# Altium schematic sheet 4_IMU.SchDoc: DB_ADCS IMU
size A4; DrawnBy: Augusto Cezar Boldori Vassoler; Revision: V1.0; SheetNumber: 4; SheetTotal: 7
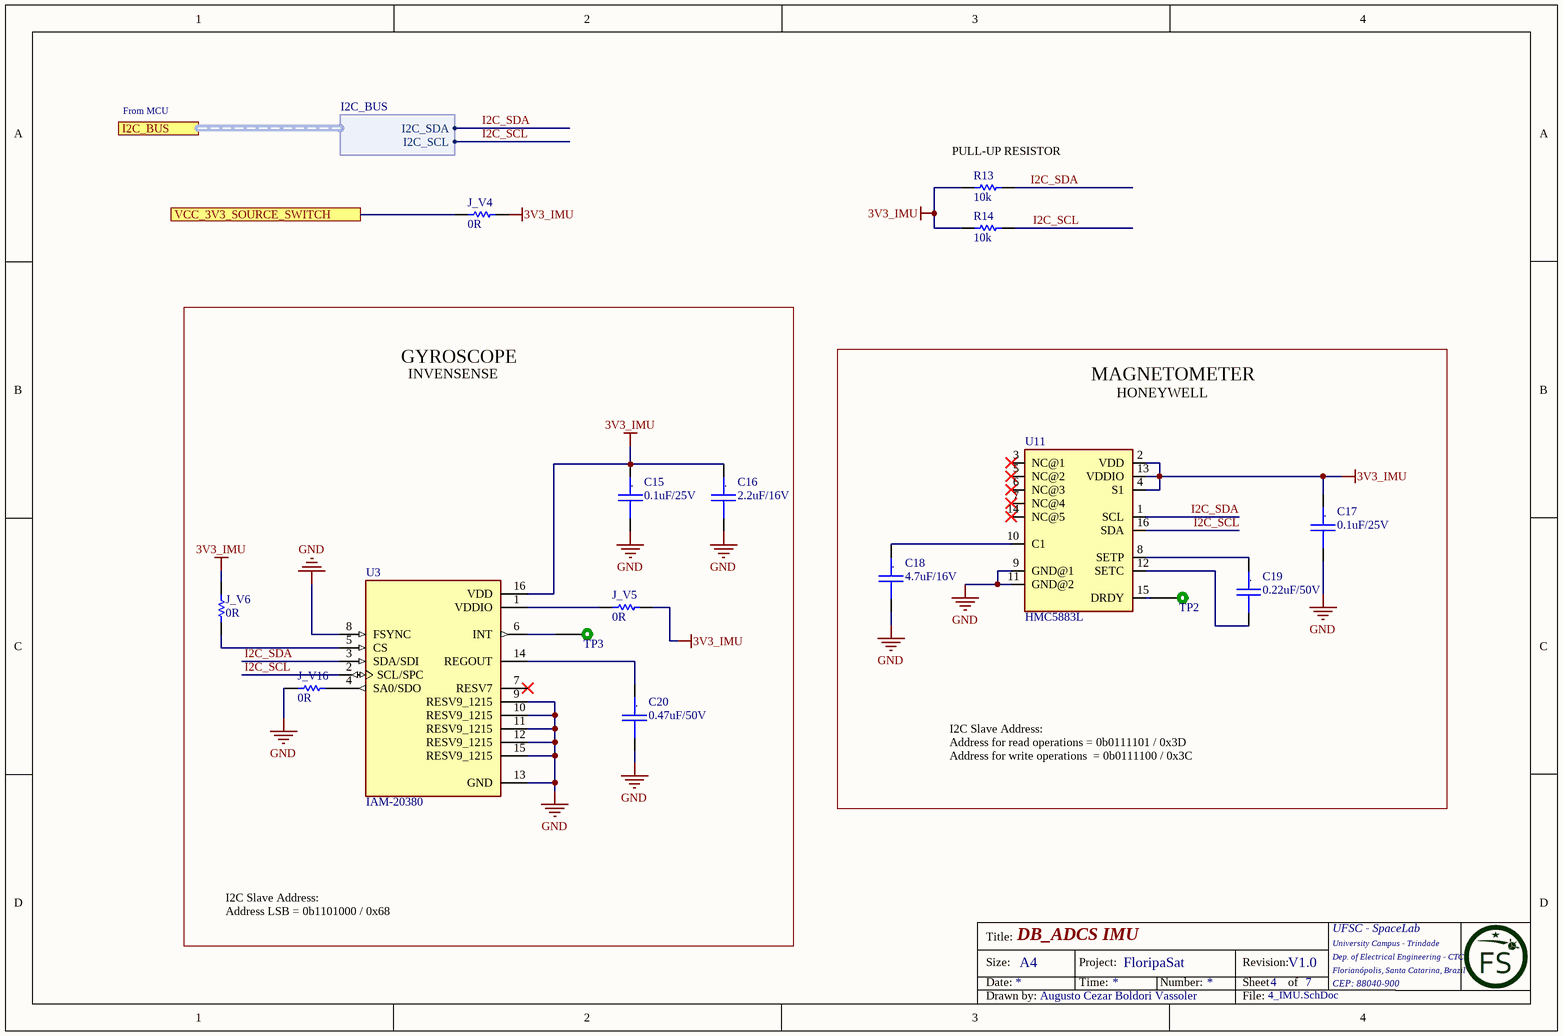
[diagram p0: 4_IMU.SchDoc]

## Parts
C15  0.1uF/25V  [CC0805]
C16  2.2uF/16V  [CC0805]
C17  0.1uF/25V  [CC0805]
C18  4.7uF/16V  [CC0805]
C19  0.22uF/50V  [CC0805]
C20  0.47uF/50V  [CC0805]
J_V4  0R  [0805-LED]
J_V5  0R  [0805-LED]
J_V6  0R  [0805-LED]
J_V16  0R  [0805-LED]
R13  10k  [0805]
R14  10k  [0805]
TP2  TEST_POINT_2  [TEST_POINT_2]  (value not drawn)  (no BOM)
TP3  TEST_POINT_2  [TEST_POINT_2]  (value not drawn)  (no BOM)
U3  IAM-20380  [PQFN50P300X300X80-16N]
U11  HMC5883L  [LPCC-16]

## Blocks framed on the sheet
GYROSCOPE: C15 C16 C20 J_V5 J_V6 J_V16 TP3 U3
MAGNETOMETER: C17-C19 TP2 U11

## Ports
I2C_BUS (harness I2C_BUS), VCC_3V3_SOURCE_SWITCH

## Harnesses
I2C_BUS: I2C_SCL, I2C_SDA

## Nets
3V3_IMU: C15.1 C16.1 C17.1 J_V4.1 J_V5.1 J_V6.2 R13.2 R14.2 U3.16(VDD) U11.2(VDD) U11.4(S1) U11.13(VDDIO)
GND: C15.2 C16.2 C17.2 C18.2 C20.2 J_V16.2 U3.8(FSYNC) U3.9(RESV9_1215) U3.10(RESV9_1215) U3.11(RESV9_1215) U3.12(RESV9_1215) U3.13(GND) U3.15(RESV9_1215) U11.9(GND@1) U11.11(GND@2)
I2C_SCL: R14.1 U3.2(SCL/SPC) U11.16(SDA) ; port I2C_BUS.I2C_SCL
I2C_SDA: R13.1 U3.3(SDA/SDI) U11.1(SCL) ; port I2C_BUS.I2C_SDA
VCC_3V3_SOURCE_SWITCH: J_V4.2 ; port VCC_3V3_SOURCE_SWITCH
NetC18_1: C18.1 U11.10(C1)
NetC19_1: C19.1 U11.8(SETP)
NetC19_2: C19.2 U11.12(SETC)
NetC20_1: C20.1 U3.14(REGOUT)
NetJ_V5_2: J_V5.2 U3.1(VDDIO)
NetJ_V6_1: J_V6.1 U3.5(CS)
NetJ_V16_1: J_V16.1 U3.4(SA0/SDO)
NetTP2_1: TP2.1 U11.15(DRDY)
NetTP3_1: TP3.1 U3.6(INT)

Not connected (* = marked no-connect by the designer): U3 7(RESV7)*; U11 3(NC@1)* 5(NC@2)* 6(NC@3)* 7(NC@4)* 14(NC@5)*

## Notes on the sheet
- From MCU
- (near R13) PULL-UP RESISTOR
- INVENSENSE
- HONEYWELL
- I2C Slave Address:
  Address for read operations = 0b0111101 / 0x3D
  Address for write operations  = 0b0111100 / 0x3C
- I2C Slave Address:
  Address LSB = 0b1101000 / 0x68
- Title:
- Size:
- Date:
- A4
- Project:
- Time:
- FloripaSat
- Number:
- Revision:
- Sheet
- of
- UFSC - SpaceLab
- University Campus - Trindade
- Dep. of Electrical Engineering - CTC
- Florianópolis, Santa Catarina, Brazil
- CEP: 88040-900
- Drawn by:
- File:
- (in symbol Cap_Cer_X7R_0.1uF_25V_0805) .
- (in symbol Cap_Cer_X7R_0.22uF_0805) .
- (in symbol Cap_Cer_X7R_0.47uF_50V_0805) .
- (in symbol Cap_Cer_X7R_2.2uF_16V_0805) .
- (in symbol Cap_Cer_X7R_4.7uF_16V_0805) .

## Library data of the parts
C15 C17 = Cap_Cer_X7R_0.1uF_25V_0805: CAP CER 0.1UF 25V 10% X7R 0805; Partnumber: CC0805KRX7R8BB104; NCM: 8532.24.10
C16 = Cap_Cer_X7R_2.2uF_16V_0805: CAP CER 2.2uF 16V 0805; Partnumber: C2012X7R1C225K125AB; NCM: 8532.24.10
C18 = Cap_Cer_X7R_4.7uF_16V_0805: Cap Ceramic 4.7uF 16V X7R 10% SMD 0805 125C Embossed T/R; Manufacturer: Kyocera AVX; Manufacturer Part Number: 0805YC475KAT2A; Voltage: 10V; Dissipation Factor: 3.5%; Supplier 1: Digi-Key; Supplier Part Number 1: 478-5722-1-ND; RoHS: Yes; Category: Ceramic Capacitors; Stock 1: 183899; Pricing 1: 1=0,51000, 10=0,36300, 100=0,23910, 500=0,17710, 1000=0,15054 (USD); Mount: Surface Mount; Case/Package: 0805; Number of Pins: 2; Case Code (Metric): 2012; Case Code (Imperial): 0805; Contact Plating: Tin,Matte; Min Operating Temperature: -55°C; Max Operating Temperature: 125°C; Capacitance: 4.7uF; Tolerance: 10%; Packaging: Tape and Reel; Voltage Rating (DC): 16V; Termination: SMD/SMT; Package Quantity: 1; Voltage Rating: 16V; Dielectric: X7R; Length: 2.01mm; Height: 1.52mm; Width: 0.049inch; Thickness: 0.06inch; Depth: 1.25mm; Radiation Hardening: No; REACH SVHC: No SVHC; Lead Free: Lead Free; ComponentLink1URL: https://datasheet.ciiva.com/11787/0900766b80dc2409-11787157.pdf?src-supplier=RSComponents; ComponentLink1Description: https://datasheet.ciiva.com/11787/0900766b80dc2409-11787157.pdf?src-supplier=RSComponents; ComponentLink2URL: https://datasheet.ciiva.com/154/cx7r-154080.pdf?src-supplier=Digi-Key; ComponentLink2Description: https://datasheet.ciiva.com/154/cx7r-154080.pdf?src-supplier=Digi-Key; ComponentLink3URL: https://datasheet.ciiva.com/154/cx7r-154081.pdf?src-supplier=Digi-Key; ComponentLink3Description: https://datasheet.ciiva.com/154/cx7r-154081.pdf?src-supplier=Digi-Key; ComponentLink4URL: https://datasheet.ciiva.com/7812/cx7r-7812213.pdf?src-supplier=Element14; ComponentLink4Description: https://datasheet.ciiva.com/7812/cx7r-7812213.pdf?src-supplier=Element14; ComponentLink5URL: https://datasheet.ciiva.com/7812/cx7r-7812214.pdf?src-supplier=Element14; ComponentLink5Description: https://datasheet.ciiva.com/7812/cx7r-7812214.pdf?src-supplier=Element14; ComponentLink6URL: https://datasheet.ciiva.com/5414/cx7r-218113-5414810.pdf?src-supplier=Mouser; ComponentLink6Description: https://datasheet.ciiva.com/5414/cx7r-218113-5414810.pdf?src-supplier=Mouser; ComponentLink7URL: https://datasheet.ciiva.com/2988/cx7r-2988060.pdf?src-supplier=Avnet; ComponentLink7Description: https://datasheet.ciiva.com/2988/cx7r-2988060.pdf?src-supplier=Avnet; ComponentLink8URL: https://datasheet.ciiva.com/16389/cx7r-16389021.pdf?src-supplier=Future+Electronics; ComponentLink8Description: https://datasheet.ciiva.com/16389/cx7r-16389021.pdf?src-supplier=Future+Electronics; ComponentLink9URL: https://datasheet.ciiva.com/154/cx7r-154079.pdf?src-supplier=Digi-Key; ComponentLink9Description: https://datasheet.ciiva.com/154/cx7r-154079.pdf?src-supplier=Digi-Key; ComponentLink10URL: https://datasheet.ciiva.com/11570/cx7r-11570847.pdf?src-supplier=Avnet; ComponentLink10Description: https://datasheet.ciiva.com/11570/cx7r-11570847.pdf?src-supplier=Avnet
C19 = Cap_Cer_X7R_0.22uF_0805: CAP CER 0.22UF 50V X7R 0805; Manufacturer: KEMET; Manufacturer Part Number: C0805C224K5RACTU; Dielectric Material: Ceramic; Capacitance: 220nF; Tolerance: 10%; Dissipation Factor: 2.5%; Supplier 1: Digi-Key; Supplier Part Number 1: 399-3491-1-ND; RoHS: Yes; Category: Ceramic Capacitors; Stock 1: 1491563; Pricing 1: 1=0,20000, 10=0,13900, 100=0,06550, 500=0,04592, 1000=0,03802 (USD); Mount: Surface Mount,PCB; Case/Package: 0805; Case Code (Metric): 2012; Case Code (Imperial): 0805; Min Operating Temperature: -55°C; Max Operating Temperature: 125°C; Packaging: Tape and Reel; Dielectric: X7R; Package Quantity: 1; Voltage Rating: 50V; Voltage Rating (DC): 50V; Termination: SMD/SMT; Voltage: 50V; Length: 2mm; Height: 1.1mm; Depth: 1.25mm; Width: 0.049inch; Thickness: 0.055inch; Lead Pitch: 0.75mm; Radiation Hardening: No; REACH SVHC: No SVHC; ComponentLink1URL: https://datasheet.ciiva.com/7842/kem-c1002-x7r-smd-7842582.pdf?src-supplier=Element14; ComponentLink1Description: https://datasheet.ciiva.com/7842/kem-c1002-x7r-smd-7842582.pdf?src-supplier=Element14; ComponentLink2URL: https://datasheet.ciiva.com/18193/getdatasheetpartid-304413-18193686.pdf?src-supplier=Verical; ComponentLink2Description: https://datasheet.ciiva.com/18193/getdatasheetpartid-304413-18193686.pdf?src-supplier=Verical; ComponentLink3URL: https://datasheet.ciiva.com/14589/70095383-14589519.pdf?src-supplier=Allied+Electronics; ComponentLink3Description: https://datasheet.ciiva.com/14589/70095383-14589519.pdf?src-supplier=Allied+Electronics; ComponentLink4URL: https://datasheet.ciiva.com/14603/70095383-14603247.pdf?src-supplier=Allied+Electronics; ComponentLink4Description: https://datasheet.ciiva.com/14603/70095383-14603247.pdf?src-supplier=Allied+Electronics; ComponentLink5URL: https://datasheet.ciiva.com/28682/1851736-28682316.pdf?src-supplier=Element14; ComponentLink5Description: https://datasheet.ciiva.com/28682/1851736-28682316.pdf?src-supplier=Element14
C20 = Cap_Cer_X7R_0.47uF_50V_0805: CAP CER 0.47UF 50V 10% X7R 0805; Partnumber: C0805C474K5RACTU; NCM: 8532.24.10
J_V4-J_V6 J_V16 = R0R_JUMPER_1/16W_0805: RES 0R OHM 1/16W JUMPER 0805; Partnumber: CRCW08050000Z0EA; NCM: 8533.21.20
R13 R14 = R10k_1%_1/8W_0805: RES 10K OHM 1/8W 1%  0805; Partnumber: CRCW080510K0FKEA; NCM: 8533.21.20
TP2 TP3 = TEST_POINT_2: Test point
U3 = IAM-20380: Gyroscope X _Pitch_, Y _Roll_, Z _Yaw_ Â±250, 500, 1000, 2000 27kHz IÂ²C, SPI 16-LGA _3x3_; MF: TDK InvenSense; Value: *; SnapEDA_Link: https://www.snapeda.com/parts/IAM-20380/TDK%20InvenSense/view-part/2757130/?ref=snap; Package: PQFN-16 TDK-InvenSense; MP: IAM-20380; Price: None; Availability: Unavailable
U11 = HMC5883L: Magnetoresistive Sensor X, Y, Z Axis 16-LCC; MF: Honeywell; MP: HMC5883L-T; Price: None; Package: LCC-16 Honeywell; SnapEDA_Link: https://www.snapeda.com/parts/HMC5883L-T/Honeywell/view-part/4349541/?ref=snap; Value: *; Availability: Unavailable